# Altium schematic sheet primary_decoupling.SchDoc: foxBMS BMS-Slave 12-Cell
size A3; DocumentNumber: 12; SheetNumber: 12; SheetTotal: 21; AUTHOR: Fraunhofer IISB foxBMS Team; SheetDescription: Primary Voltage Measurement
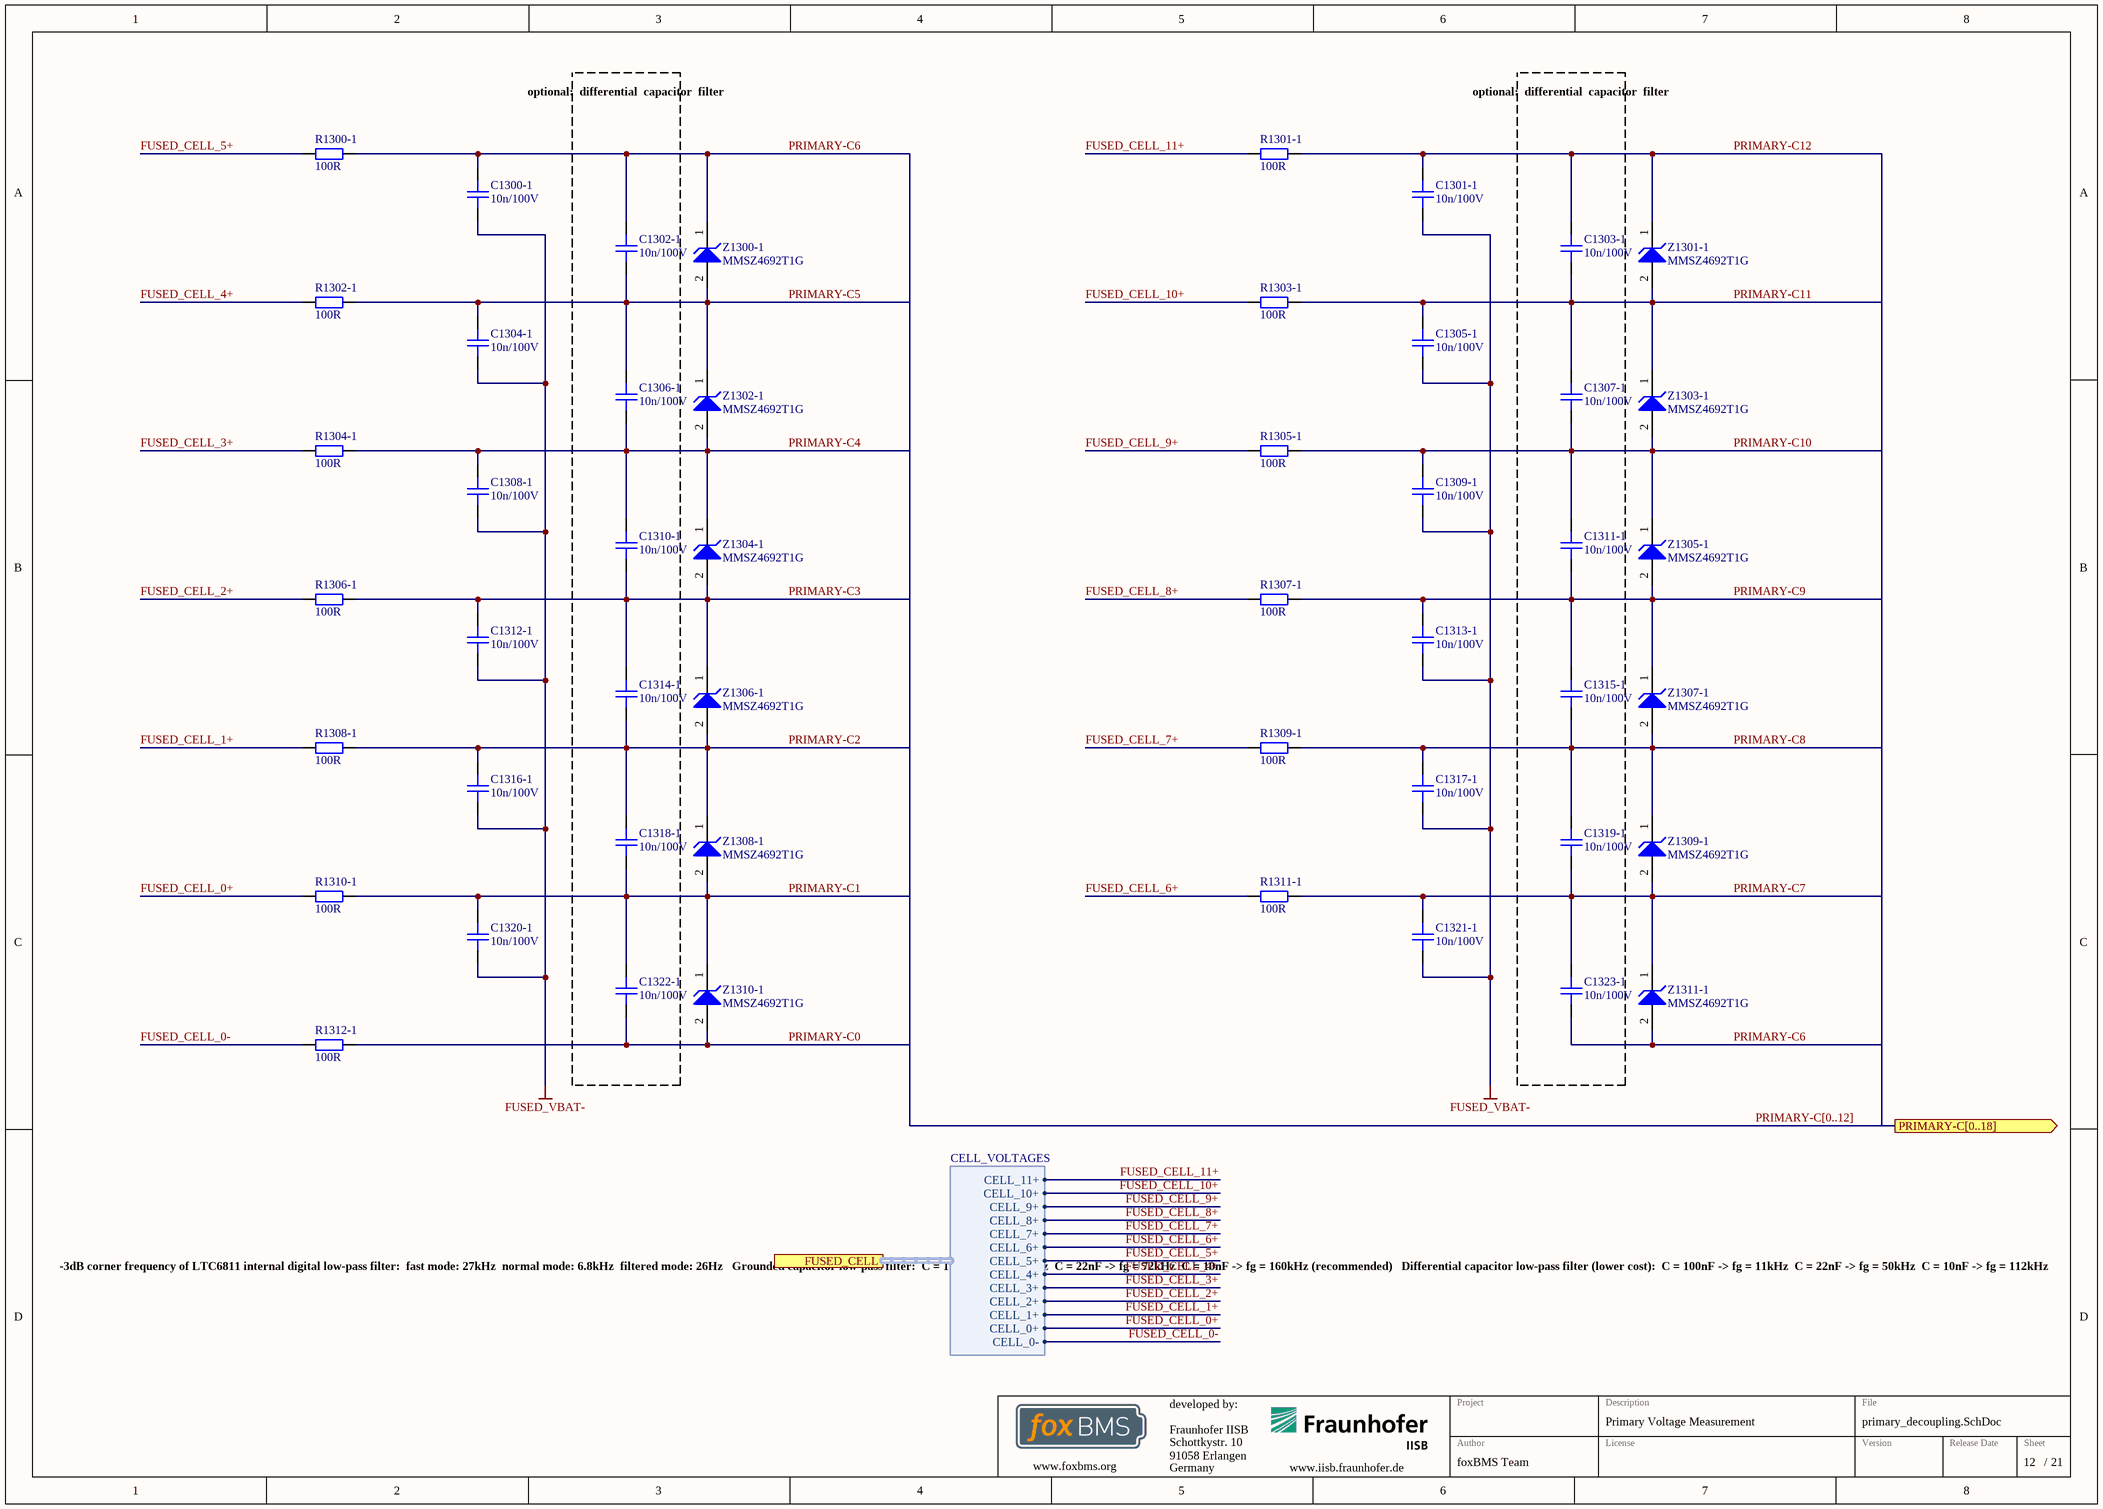
[diagram p0: primary_decoupling.SchDoc]

## Parts
C1300-1  10n/100V  [CAPC1608X08N]
C1301-1  10n/100V  [CAPC1608X08N]
C1302-1  10n/100V  [CAPC1608X08N]
C1303-1  10n/100V  [CAPC1608X08N]
C1304-1  10n/100V  [CAPC1608X08N]
C1305-1  10n/100V  [CAPC1608X08N]
C1306-1  10n/100V  [CAPC1608X08N]
C1307-1  10n/100V  [CAPC1608X08N]
C1308-1  10n/100V  [CAPC1608X08N]
C1309-1  10n/100V  [CAPC1608X08N]
C1310-1  10n/100V  [CAPC1608X08N]
C1311-1  10n/100V  [CAPC1608X08N]
C1312-1  10n/100V  [CAPC1608X08N]
C1313-1  10n/100V  [CAPC1608X08N]
C1314-1  10n/100V  [CAPC1608X08N]
C1315-1  10n/100V  [CAPC1608X08N]
C1316-1  10n/100V  [CAPC1608X08N]
C1317-1  10n/100V  [CAPC1608X08N]
C1318-1  10n/100V  [CAPC1608X08N]
C1319-1  10n/100V  [CAPC1608X08N]
C1320-1  10n/100V  [CAPC1608X08N]
C1321-1  10n/100V  [CAPC1608X08N]
C1322-1  10n/100V  [CAPC1608X08N]
C1323-1  10n/100V  [CAPC1608X08N]
R1300-1  100R  [RESC1608X05N]
R1301-1  100R  [RESC1608X05N]
R1302-1  100R  [RESC1608X05N]
R1303-1  100R  [RESC1608X05N]
R1304-1  100R  [RESC1608X05N]
R1305-1  100R  [RESC1608X05N]
R1306-1  100R  [RESC1608X05N]
R1307-1  100R  [RESC1608X05N]
R1308-1  100R  [RESC1608X05N]
R1309-1  100R  [RESC1608X05N]
R1310-1  100R  [RESC1608X05N]
R1311-1  100R  [RESC1608X05N]
R1312-1  100R  [RESC1608X05N]
Z1300-1  MMSZ4692T1G  [ONSC-SOD-123-2-425-04_V]
Z1301-1  MMSZ4692T1G  [ONSC-SOD-123-2-425-04_V]
Z1302-1  MMSZ4692T1G  [ONSC-SOD-123-2-425-04_V]
Z1303-1  MMSZ4692T1G  [ONSC-SOD-123-2-425-04_V]
Z1304-1  MMSZ4692T1G  [ONSC-SOD-123-2-425-04_V]
Z1305-1  MMSZ4692T1G  [ONSC-SOD-123-2-425-04_V]
Z1306-1  MMSZ4692T1G  [ONSC-SOD-123-2-425-04_V]
Z1307-1  MMSZ4692T1G  [ONSC-SOD-123-2-425-04_V]
Z1308-1  MMSZ4692T1G  [ONSC-SOD-123-2-425-04_V]
Z1309-1  MMSZ4692T1G  [ONSC-SOD-123-2-425-04_V]
Z1310-1  MMSZ4692T1G  [ONSC-SOD-123-2-425-04_V]
Z1311-1  MMSZ4692T1G  [ONSC-SOD-123-2-425-04_V]

## Blocks framed on the sheet
optional: / differential / capacitor / filter: C1302-1 C1306-1 C1310-1 C1314-1 C1318-1 C1322-1
optional: / differential / capacitor / filter: C1303-1 C1307-1 C1311-1 C1315-1 C1319-1 C1323-1

## Ports
FUSED_CELL (harness CELL_VOLTAGES), PRIMARY-C[0..18] (out)

## Harnesses
CELL_VOLTAGES: CELL_0-, CELL_0+, CELL_1+, CELL_10+, CELL_11+, CELL_2+, CELL_3+, CELL_4+, CELL_5+, CELL_6+, CELL_7+, CELL_8+, CELL_9+

## Nets
FUSED_VBAT-: C1300-1.2 C1301-1.2 C1304-1.2 C1305-1.2 C1308-1.2 C1309-1.2 C1312-1.2 C1313-1.2 C1316-1.2 C1317-1.2 C1320-1.2 C1321-1.2
FUSED_CELL_0+: R1310-1.1 ; port FUSED_CELL.CELL_0+
FUSED_CELL_0-: R1312-1.1 ; port FUSED_CELL.CELL_0-
FUSED_CELL_1+: R1308-1.1 ; port FUSED_CELL.CELL_1+
FUSED_CELL_2+: R1306-1.1 ; port FUSED_CELL.CELL_2+
FUSED_CELL_3+: R1304-1.1 ; port FUSED_CELL.CELL_3+
FUSED_CELL_4+: R1302-1.1 ; port FUSED_CELL.CELL_4+
FUSED_CELL_5+: R1300-1.1 ; port FUSED_CELL.CELL_5+
FUSED_CELL_6+: R1311-1.1 ; port FUSED_CELL.CELL_6+
FUSED_CELL_7+: R1309-1.1 ; port FUSED_CELL.CELL_7+
FUSED_CELL_8+: R1307-1.1 ; port FUSED_CELL.CELL_8+
FUSED_CELL_9+: R1305-1.1 ; port FUSED_CELL.CELL_9+
FUSED_CELL_10+: R1303-1.1 ; port FUSED_CELL.CELL_10+
FUSED_CELL_11+: R1301-1.1 ; port FUSED_CELL.CELL_11+
PRIMARY-C0: C1322-1.2 R1312-1.2 Z1310-1.2(A)
PRIMARY-C1: C1318-1.2 C1320-1.1 C1322-1.1 R1310-1.2 Z1308-1.2(A) Z1310-1.1(K)
PRIMARY-C2: C1314-1.2 C1316-1.1 C1318-1.1 R1308-1.2 Z1306-1.2(A) Z1308-1.1(K)
PRIMARY-C3: C1310-1.2 C1312-1.1 C1314-1.1 R1306-1.2 Z1304-1.2(A) Z1306-1.1(K)
PRIMARY-C4: C1306-1.2 C1308-1.1 C1310-1.1 R1304-1.2 Z1302-1.2(A) Z1304-1.1(K)
PRIMARY-C5: C1302-1.2 C1304-1.1 C1306-1.1 R1302-1.2 Z1300-1.2(A) Z1302-1.1(K)
PRIMARY-C6: C1300-1.1 C1302-1.1 C1323-1.2 R1300-1.2 Z1300-1.1(K) Z1311-1.2(A)
PRIMARY-C7: C1319-1.2 C1321-1.1 C1323-1.1 R1311-1.2 Z1309-1.2(A) Z1311-1.1(K)
PRIMARY-C8: C1315-1.2 C1317-1.1 C1319-1.1 R1309-1.2 Z1307-1.2(A) Z1309-1.1(K)
PRIMARY-C9: C1311-1.2 C1313-1.1 C1315-1.1 R1307-1.2 Z1305-1.2(A) Z1307-1.1(K)
PRIMARY-C10: C1307-1.2 C1309-1.1 C1311-1.1 R1305-1.2 Z1303-1.2(A) Z1305-1.1(K)
PRIMARY-C11: C1303-1.2 C1305-1.1 C1307-1.1 R1303-1.2 Z1301-1.2(A) Z1303-1.1(K)
PRIMARY-C12: C1301-1.1 C1303-1.1 R1301-1.2 Z1301-1.1(K)

## Buses and harness runs
bus PRIMARY-C[0..12] = port PRIMARY-C[0..18]

## Notes on the sheet
- -3dB corner frequency of LTC6811 internal digital low-pass filter:
  fast mode: 27kHz
  normal mode: 6.8kHz
  filtered mode: 26Hz
  Grounded capacitor low-pass filter:
  C = 100nF -> fg = 16kHz
  C = 22nF -> fg = 72kHz
  C = 10nF -> fg = 160kHz (recommended)
  Differential capacitor low-pass filter (lower cost):
  C = 100nF -> fg = 11kHz
  C = 22nF -> fg = 50kHz
  C = 10nF -> fg = 112kHz
- Fraunhofer IISB
- Schottkystr. 10
- developed by:
- 91058 Erlangen
- Germany
- Author
- Project
- License
- Description
- File
- Version
- Release Date
- Sheet
- www.foxbms.org
- www.iisb.fraunhofer.de
- foxBMS Team
- /

## Library data of the parts
C1300-1 C1301-1 C1302-1 C1303-1 C1304-1 C1305-1 C1306-1 C1307-1 C1308-1 C1309-1 C1310-1 C1311-1 C1312-1 C1313-1 C1314-1 C1315-1 C1316-1 C1317-1 C1318-1 C1319-1 C1320-1 C1321-1 C1322-1 C1323-1 = gen_C_ceramic_10n_100V_X7R_0603: MLCC; Capacitance: 10n; Rated Voltage: 100V; Dielectric: X7R; Case EIA: 0603; Case Metric: 1608; Automotive Qualified: True; PnP Package: C_0603_10; PnP Value: 10n/100V/X7R; Part Number: gen_C_ceramic_10n_100V_X7R_0603; Supplier 1: Farnell; Supplier Part Number 1: 1301715; Supplier 2: Farnell; Supplier 3: Farnell; Supplier Part Number 2: 2821192; Supplier Part Number 3: 2210878
R1300-1 R1301-1 R1302-1 R1303-1 R1304-1 R1305-1 R1306-1 R1307-1 R1308-1 R1309-1 R1310-1 R1311-1 R1312-1 = gen_R_100R_0603: SMD Resistor 100R 0603; Tolerance: 1%; Power: 0.1W; Case EIA: 0603; Case Metric: 1608; Maximum Working Voltage: 75V; PnP Package: R_0603; Automotive Qualified: False; Part Number: gen_R_100R_0603; Operating Temperature: -55°C - +155°C; Resistance: 100R; Series: E24, E96; PnP Value: 100R; Supplier 1: Farnell; Supplier Part Number 1: 1469752
Z1300-1 Z1301-1 Z1302-1 Z1303-1 Z1304-1 Z1305-1 Z1306-1 Z1307-1 Z1308-1 Z1309-1 Z1310-1 Z1311-1 = CMP-1060-00434-1: Zener Voltage Regulator, 500 mW, 2-Pin SOD-123, Pb-Free, Tape and Reel; Manufacturer: On Semiconductor; VZ Typ (V): 6.8; P Max (W): 0.5; ComponentLink2URL: http://www.onsemi.com/pub_link/Collateral/MMSZ4678T1-D.PDF; Mounting Technology: Surface Mount; DatasheetVersion: Rev. 9; ComponentLink1Description: Manufacturer URL; ComponentLink3URL: http://www.onsemi.com/pub_link/Collateral/425-04.PDF; PackageReference: SOD-123-2-425-04; ComponentLink2Description: Datasheet; RoHS: Pb-Free; Packing: Tape and Reel; ComponentLink1URL: http://www.onsemi.com/; PackageDescription: 2-Pin SOD, Body 1.6 x 2.69 mm; ComponentLink3Description: Package Specification; PartNumber: MMSZ4692T1G; PackageVersion: Rev. G, 10/2009